# Altium schematic sheet RX_Power.SchDoc
size A; SheetNumber: 2; SheetTotal: 4
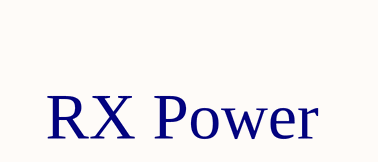
[diagram p0: RX_Power.SchDoc]

## Notes on the sheet
- RX Power